# EAGLE design control board (EAGLE 9.6.2)
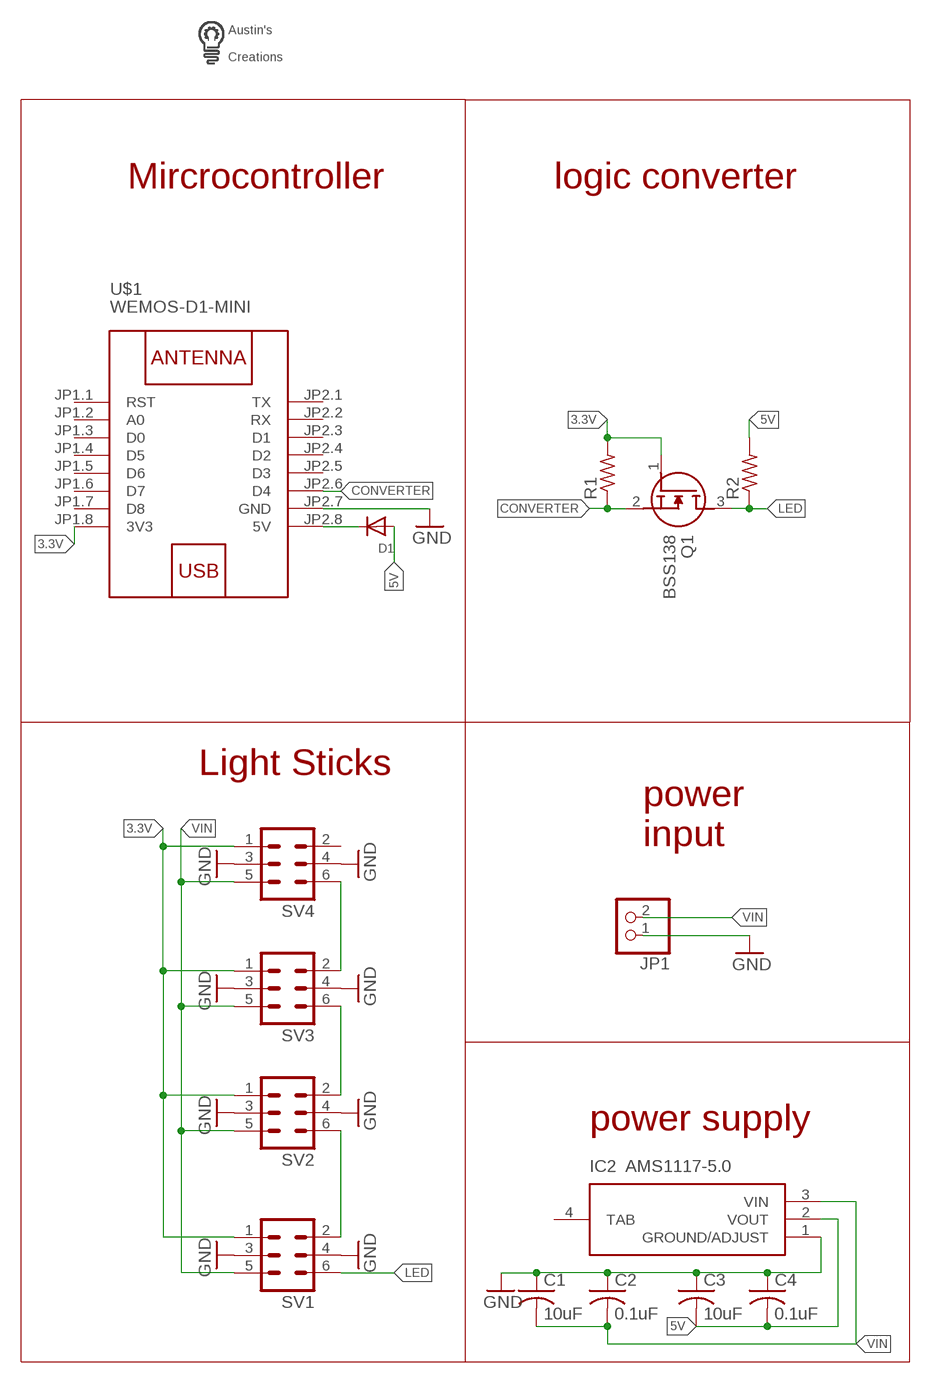
[diagram p0: schematic, sheet 1]

## Parts
C1  10uF  C-USC0603  [C0603]
C2  0.1uF  C-USC0603  [C0603]
C3  10uF  C-USC0603  [C0603]
C4  0.1uF  C-USC0603  [C0603]
D1  DIODESOD-123  [SOD-123]
IC2  AMS1117-5.0  [SOT229P700X180-4N]
JP1  PINHD-1X2  [1X02]
Q1  BSS138  [SOT95P240X120-3N]
R1  R-US_R0603  [R0603]
R2  R-US_R0603  [R0603]
SV1  MA03-2  [MA03-2]
SV2  MA03-2  [MA03-2]
SV3  MA03-2  [MA03-2]
SV4  MA03-2  [MA03-2]
U$1  WEMOS-D1-MINI  [WEMOS-D1-MINI]
U$2  LOGO  [LOGO]

## Nets
3.3V: Q1.1(G) R1.2 SV1.1 SV2.1 SV3.1 SV4.1 U$1.JP1.8(3V3)
5V: C3.2 C4.2 D1.A IC2.2(VOUT) R2.2
CONVERTER: Q1.2(S) R1.1 U$1.JP2.6(D4)
GND: C1.1 C2.1 C3.1 C4.1 IC2.1(GROUND/ADJUST) JP1.1 SV1.3 SV1.4 SV2.3 SV2.4 SV3.3 SV3.4 SV4.3 SV4.4 U$1.JP2.7(GND)
LED: Q1.3(D) R2.1 SV1.6
N$7: D1.C U$1.JP2.8(5V)
N$10: SV1.2 SV2.6
N$11: SV2.2 SV3.6
N$12: SV3.2 SV4.6
VIN: C1.2 C2.2 IC2.3(VIN) JP1.2 SV1.5 SV2.5 SV3.5 SV4.5
Unconnected: IC2.4(TAB) SV4.2 U$1.JP1.1(RST) U$1.JP1.2(A0) U$1.JP1.3(D0) U$1.JP1.4(D5) U$1.JP1.5(D6) U$1.JP1.6(D7) U$1.JP1.7(D8) U$1.JP2.1(TX) U$1.JP2.2(RX) U$1.JP2.3(D1) U$1.JP2.4(D2) U$1.JP2.5(D3)

## Notes on the sheet
- Mircrocontroller | logic converter
- Light Sticks
- power
  input
- power supply

## Library data of the parts
C1-C4 = adafruit:C-US: CAPACITOR, American symbol
D1 = adafruit:DIODE: Diode SMADIODE - SMA Surface Mount Package 20V 1A Schottky Diode Digikey: 641-1014-6-ND DO-1N4148 - Through Hole Small Current Diode SOD-123 20V 1 A (.5mV Vf) Schottky Diode - Digikey: MBRX120TPMSCT-ND SOD-323 10V 570mA (.38mV Vf, 3ns) Schottky Diode - Digikey: ZLLS410CT-ND SOD-523 30V 30mA Schottky Diode (RB751S-40TE61) - Digikey: RB751S-40TE61CT-ND SOT23-R/W - SOT23 Package (R = Solder Paste/Reflow Ovens, W = Hand-Soldering) BAT54Film 40V 300mA - Digikey: 497-7162-1-ND
IC2 = SamacSys_Parts:AMS1117-5.0: 1A LOW DROPOUT VOLTAGE REGULATOR Source: Datasheet <http://www.advanced-monolithic.com/pdf/ds1117.pdf>; DESCRIPTION: 1A LOW DROPOUT VOLTAGE REGULATOR; HEIGHT: 1.8mm; MANUFACTURER_NAME: Advanced Monolithic Systems; MANUFACTURER_PART_NUMBER: AMS1117-5.0
JP1 = pinhead:PINHD-1X2: PIN HEADER
Q1 = SamacSys_Parts:BSS138: N-channel MOSFET,BSS138 0.2A 50V Source: Datasheet <https://www.onsemi.com/pub/Collateral/BSS138-D.PDF>; ARROW_PART_NUMBER: BSS138; ARROW_PRICE-STOCK: https://www.arrow.com/en/products/bss138/on-semiconductor; DESCRIPTION: N-channel MOSFET,BSS138 0.2A 50V; HEIGHT: 1.2mm; MANUFACTURER_NAME: ON Semiconductor; MANUFACTURER_PART_NUMBER: BSS138; MOUSER_PART_NUMBER: 512-BSS138; MOUSER_PRICE-STOCK: https://www.mouser.co.uk/ProductDetail/ON-Semiconductor-Fairchild/BSS138?qs=HK%252BeIG1iaahCeqBvjB4arg%3D%3D
R1 R2 = rcl:R-US_: RESISTOR, American symbol; SPICEPREFIX: R
SV1-SV4 = con-lstb:MA03-2: PIN HEADER; OC_FARNELL: unknown; OC_NEWARK: unknown
U$1 = diy-modules:WEMOS-D1-MINI: WEMOS D1 mini: Mini Wi-Fi Board based on ESP-8266 device More details can be found here: https://www.wemos.cc/product/d1-mini.html Click here to find device on ebay.com <http://www.ebay.com/sch/wemos+d1+mini+nodemcu>
U$2 = custom parts:LOGO

## Board
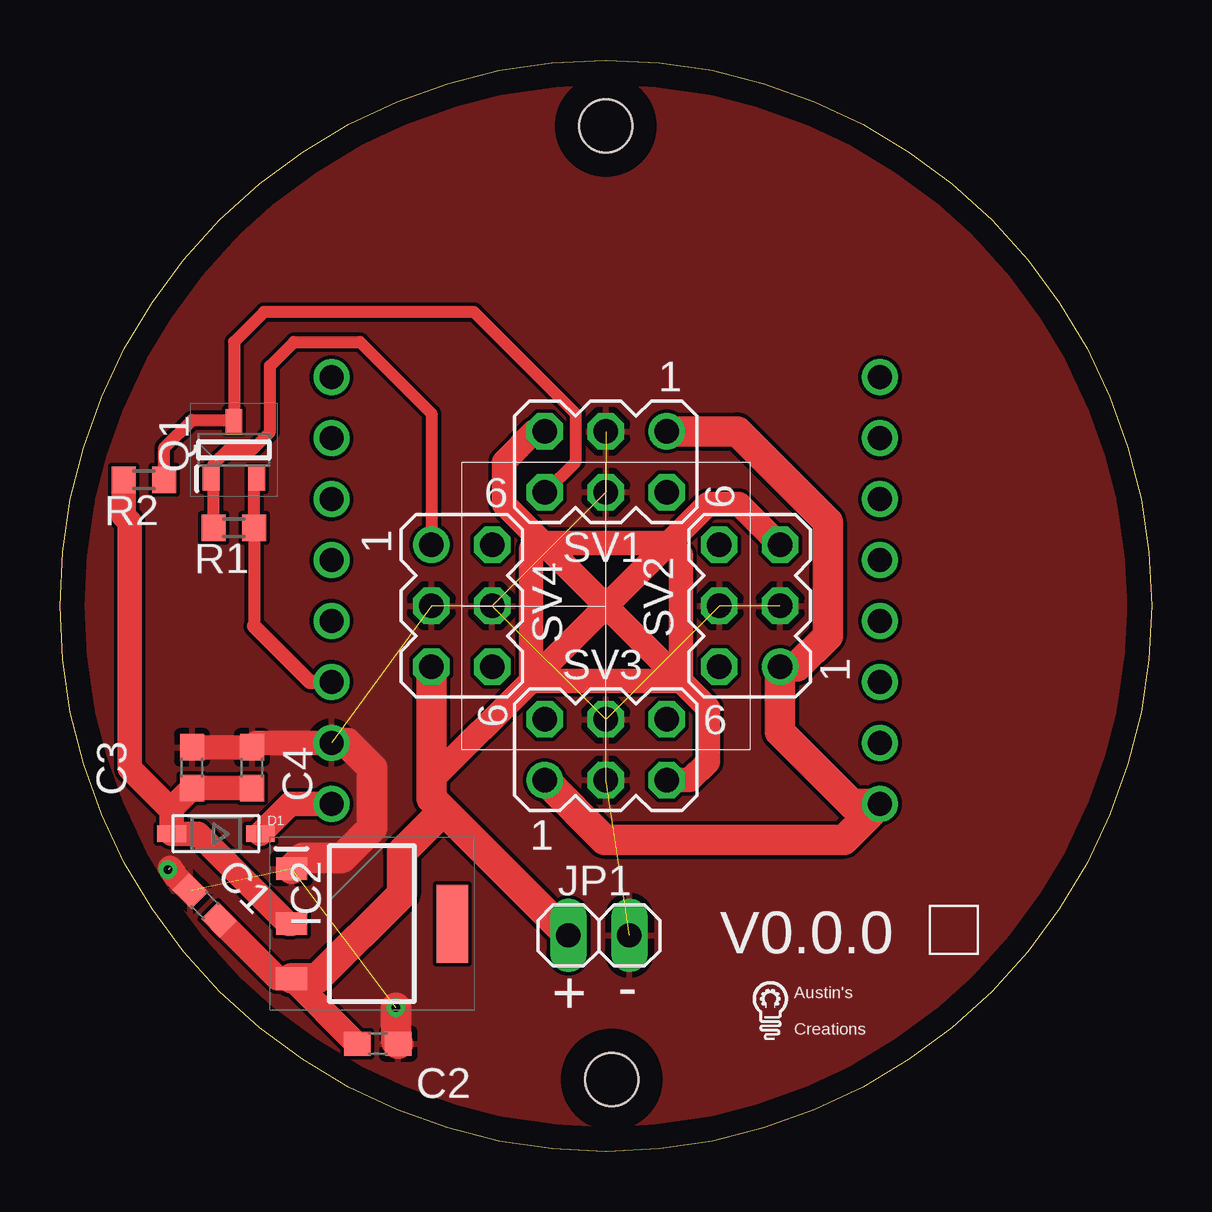
[diagram p1: board, top side]
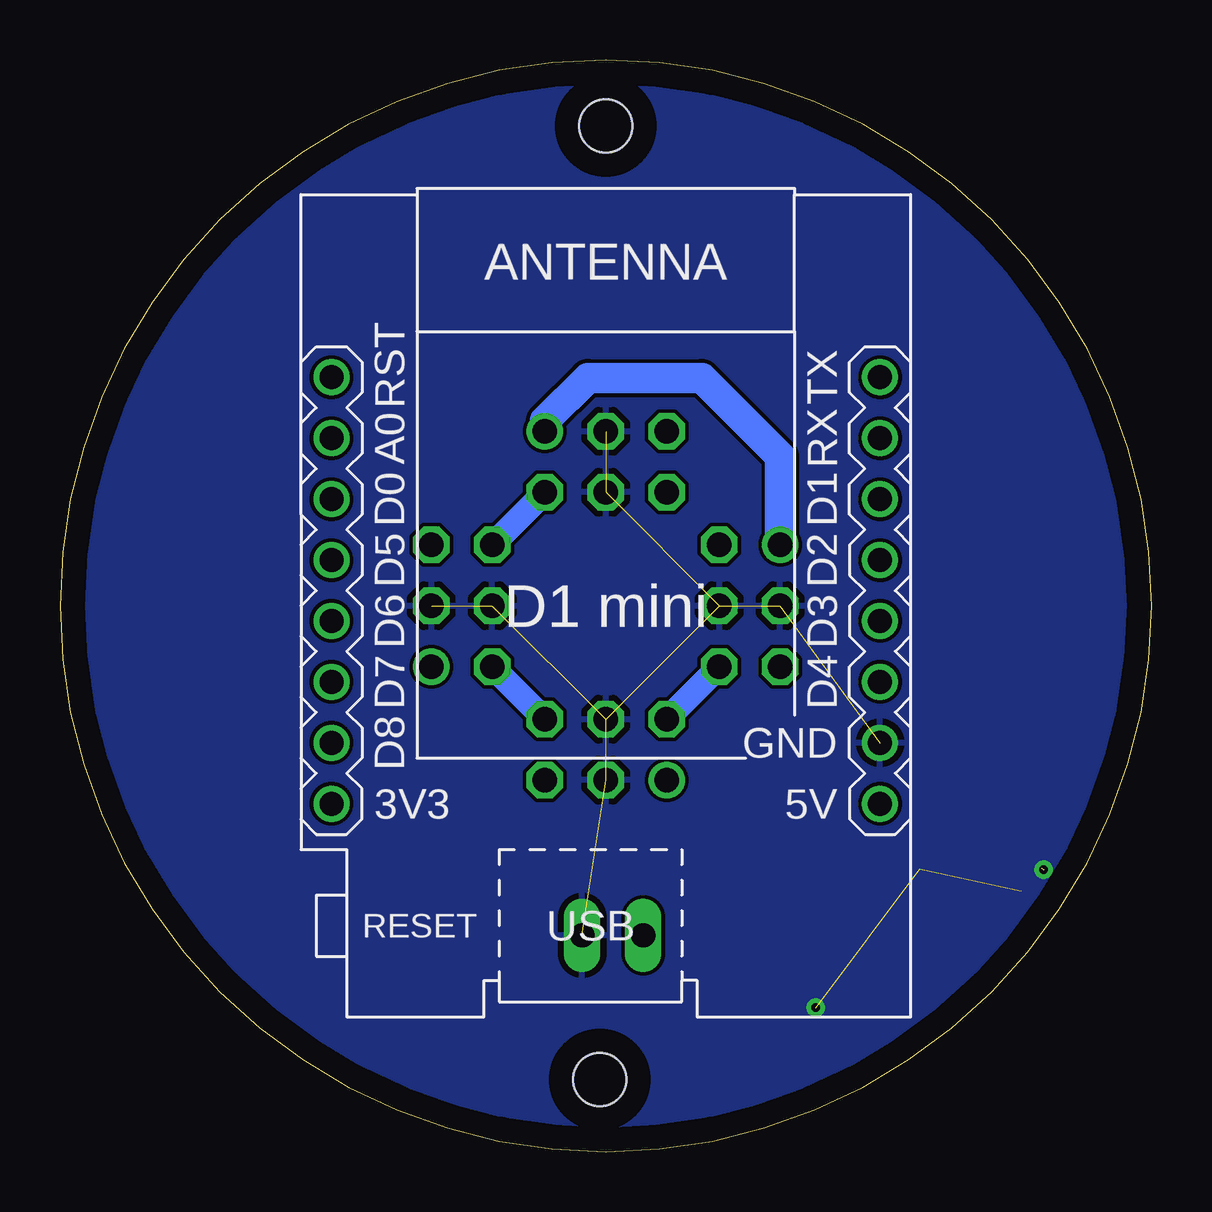
[diagram p2: board, bottom side, seen from below]

Size 45.5 x 45.5 mm. Coordinates in mm from the lower left corner, seen from the top.
Outline: 22.75,0 arc-180 22.75,45.5 arc-180 22.75,0
Copper layers (1*16): Top 0.035mm / dielectric 1.5mm / Bottom 0.035mm
Design rules "default *": minimum track width 10mil, minimum drill 0.35mm, track to track 6mil, track to pad 6mil, pad to pad 6mil, via to via 6mil, smd to smd 6mil, copper to edge 40mil, drill to drill 6mil, minimum pad ring 10mil, minimum via ring 8mil, stop-mask expansion 4mil, vias tented up to drill 0mil, thermal gap 10mil
Holes 2.2 mm at 22.75,42.75 23,3

### Footprints (pad centres in the part's own frame; a part is rotated, then mirrored left to right if it is on the bottom)
C0603 = smd 1.1 x 1: 1 -0.85,0; 2 0.85,0
SOD-123 = smd 1.2 x 0.7: A 1.85,0; C -1.85,0
SOT229P700X180-4N = smd 1.3 x 0.95: 1 -3.35,2.29; 2 -3.35,0; 3 -3.35,-2.29 | smd 1.3 x 3.25: 4 3.35,0
1X02 = drill 1.016 long: 1 -1.27,0; 2 1.27,0
SOT95P240X120-3N = smd 1 x 0.7: 1 -1.2,0.95; 2 -1.2,-0.95; 3 1.2,0
R0603 = smd 1 x 1.1: 1 -0.85,0; 2 0.85,0
MA03-2 = drill 1.016: 1 -2.54,-1.27 | drill 1.016 octagon: 2 -2.54,1.27; 3 0,-1.27; 4 0,1.27; 5 2.54,-1.27; 6 2.54,1.27
WEMOS-D1-MINI = drill 1: JP1.1 -11.43,9.525; JP1.2 -11.43,6.985; JP1.3 -11.43,4.445; JP1.4 -11.43,1.905; JP1.5 -11.43,-0.635; JP1.6 -11.43,-3.175; JP1.7 -11.43,-5.715; JP1.8 -11.43,-8.255; JP2.1 11.43,9.525; JP2.2 11.43,6.985; JP2.3 11.43,4.445; JP2.4 11.43,1.905; JP2.5 11.43,-0.635; JP2.6 11.43,-3.175; JP2.7 11.43,-5.715; JP2.8 11.43,-8.255

### Placement (x,y rotation side)
C1  6.03,10.26 315 top
C2  13.25,4.5 180 top
C3  5.5,16 270 top
C4  8,16 270 top
D1  6.5,13.25 180 top
IC2  13,9.5 0 top
JP1  22.46,9.01 180 top
Q1  7.25,29.25 90 top
R1  7.25,26 180 top
R2  3.5,28 180 top
SV1  22.75,28.75 180 top
SV2  28.75,22.75 90 top
SV3  22.75,16.75 0 top
SV4  16.75,22.75 270 top
U$1  22.75,22.75 0 bottom
U$2  28.89,4.66 0 top

### Tracks (layer width: path | path; a pad name or v marks a point on that pad's centre or on a via)
3.3V
  Top 0.508: R1.2 6.4,27.95 | 6.4,27.95 Q1.1 | 6.4,27.95 6.4,28.65 7,29.25 8,29.25 8.75,30 8.75,32.75 9.75,33.75 12.5,33.75 15.48,30.77 SV4.1
  Top 1.27: SV3.1 22.69,13 32.69,13 U$1.JP1.8 33.01,14.49 30.02,17.48 SV2.1 30.71,20.21 32,21.5 32,26.25 28.23,30.02 SV1.1
  Bottom 1.27: SV4.1 15.48,28.98 18.75,32.25 23.5,32.25 25.29,30.46 SV1.1
5V
  Top 1.016: 4.65,14.3 D1.A 5.75,13.25 9.5,9.5 IC2.2 | 4.65,14.3 C3.2 C4.2 | R2.2 2.65,26.5 2.9,26.25 2.9,15.97 4.57,14.3 4.65,14.3
CONVERTER
  Top 0.508: Q1.2 8.1,27.95 R1.1 8.1,21.9
  Top 0.61: 8.1,21.9 10.43,19.57 U$1.JP2.6
GND  (via drill 0.35)  (12 unrouted)
  Top 1.016: C3.1 C4.1 8.19,17.04 U$1.JP2.7 | C1.1 4.87,11.42 4.59,11.81
  Top 1.27: IC2.1 10.11,12.25 11.75,12.25 13,13.5 13,16 11.96,17.04 U$1.JP2.7 | C2.1 14,4.6 v14,6
  other vias: 4.5,11.75
  pour Bottom: 22.75,45.5 arc90 0,22.75 arc90 22.75,0 arc90 45.5,22.75 arc90
  pour Top: 22.75,45.5 arc90 0,22.75 arc90 22.75,0 arc90 45.5,22.75 arc90
LED
  Top 0.508: R2.1 4.35,29.35 5.5,30.5 7.2,30.5 Q1.3 7.25,33.75 8.5,35 17.25,35 21.5,30.75 21.5,28.77 SV1.6
N$7
  Top 1.016: D1.C 9.6,14.49 U$1.JP2.8
N$10
  Bottom 1.016: SV1.2 SV2.6
N$11
  Bottom 1.016: SV2.2 SV3.6
N$12
  Bottom 1.016: SV4.6 SV3.2
VIN
  Top 1.016: C1.2 9.08,7.21 IC2.3 12.36,4.5 C2.2 | 15.48,14.72 15.48,15.48 19.62,19.62 | SV2.5 28.31,27 27,27 25.38,25.38 | 22.75,22.75 19.62,19.62 | 22.75,22.75 25.38,25.38 | SV1.5 19.77,30.02 18.5,28.75 18.5,27 20,25.5 | 22.75,22.75 20.12,25.38 | 22.75,22.75 25.88,19.62 | 25.88,19.62 27,18.5 27,16.25 26.23,15.48 SV3.5 | 19.62,19.62 25.88,19.62 | 19.62,19.62 19.62,25.12 20,25.5 | 20,25.5 20.12,25.38 | 20.12,25.38 25.38,25.38 | 25.38,25.38 25.88,24.88 25.88,19.62
  Top 1.27: JP1.2 15.98,14.22 | 15.98,14.22 15.48,14.72 SV4.5 | 15.98,14.22 14.25,12.49 14.25,10.75 10.71,7.21 IC2.3

### Text on the board
tPlace: V0.0.0 | + | -